# Altium schematic sheet EsquematicoCam.SchDoc
size A4
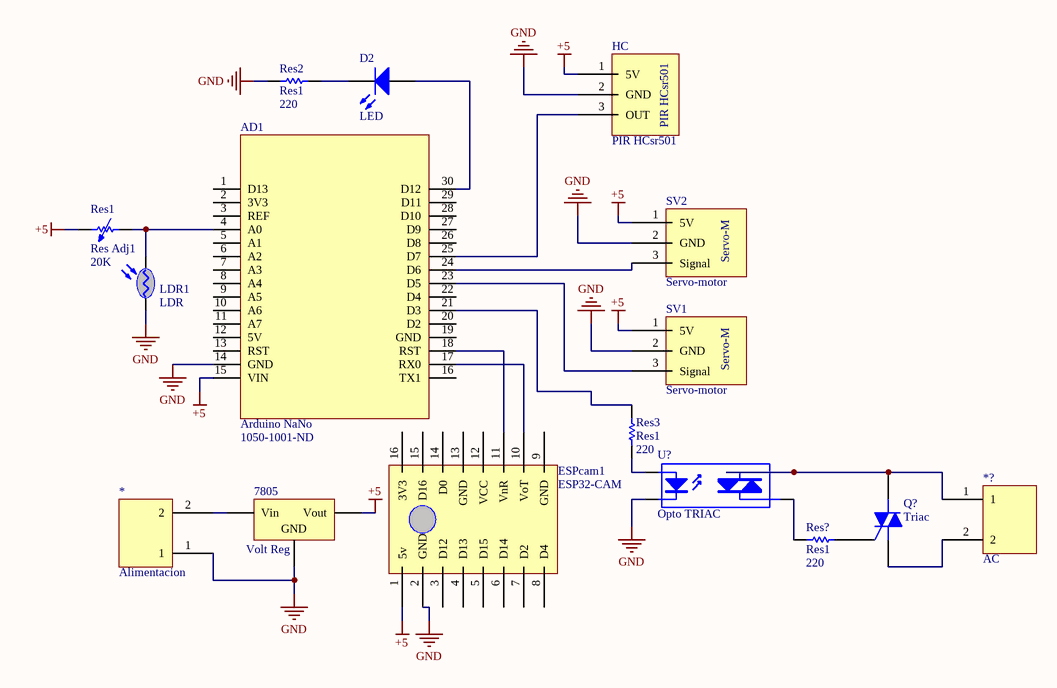
[diagram p0: EsquematicoCam.SchDoc]

## Parts
7805  Volt Reg  [D2PAK_N]
*  Alimentacion  [bornera chica]
*?  AC  [bornera chica]
AD1  Arduino NaNo  Supplier Part Number 1: 1050-1001-ND  [Arduino Nano]
D2  LED  [LED-0 5mm BLUE]
ESPcam1  ESP32-CAM
HC  PIR HCsr501
LDR1  LDR  [CDS]
Q?  Triac  [369-03]
Res1  Res Adj1  value 20K  [AXIAL-0.7]
Res2  Res1  value 220  [AXIAL-0.3]
Res3  Res1  value 220  [AXIAL-0.3]
Res?  Res1  value 220  [AXIAL-0.3]
SV1  Servo-motor
SV2  Servo-motor
U?  Opto TRIAC  [NPSIP4A]

## Nets
+5: 7805.3(Vout) AD1.15(VIN) ESPcam1.1(5v) HC.1(5V) Res1.2 SV1.1(5V) SV2.1(5V)
GND: 7805.2(GND) *.1 AD1.14(GND) ESPcam1.2(GND) HC.2(GND) LDR1.1(A) Res2.1 SV1.2(GND) SV2.2(GND) U?.2(K)
Net7805_1: 7805.1(Vin) *.2
Net*?_1: *?.1 Q?.2(M2) U?.3(A/K)
Net*?_2: *?.2 Q?.1(M1)
NetAD1_4: AD1.4(A0) LDR1.2(K) Res1.1
NetAD1_17: AD1.17(RX0) ESPcam1.10(VoT)
NetAD1_18: AD1.18(RST) ESPcam1.11(VnR)
NetAD1_21: AD1.21(D3) Res3.2
NetAD1_23: AD1.23(D5) SV1.3(Signal)
NetAD1_24: AD1.24(D6) SV2.3(Signal)
NetAD1_25: AD1.25(D7) HC.3(OUT)
NetAD1_30: AD1.30(D12) D2.1(A)
NetD2_2: D2.2(K) Res2.2
NetQ?_3: Q?.3(G) Res?.2
NetRes3_1: Res3.1 U?.1(A)
NetRes?_1: Res?.1 U?.4(A/K)

Not connected (* = marked no-connect by the designer): AD1 1(D13) 2(3V3) 3(REF) 5(A1) 6(A2) 7(A3) 8(A4) 9(A5) 10(A6) 11(A7) 12(5V) 13(RST) 16(TX1) 19(GND) 20(D2) 22(D4) 26(D8) 27(D9) 28(D10) 29(D11); ESPcam1 3(D12) 4(D13) 5(D15) 6(D14) 7(D2) 8(D4) 9(GND) 12(VCC) 13(GND) 14(D0) 15(D16) 16(3V3)

## Notes on the sheet
- (in symbol SERVO-MOTOR) Servo-M

## Library data of the parts
7805 = Volt Reg: Voltage Regulator; Published: 24-Mar-1999; LatestRevisionDate: 29-May-2009; LatestRevisionNote: IPC-7351 Footprint Added.; PackageReference: D2PAK; Publisher: Altium Limited; PackageDescription: 3-Pin Transistor Outline Package 2.54 mm Pitch, 15.1 mm Lead Span
* *? = bornera
D2 = LED: Typical LED; Published: 8-Jun-2000; LatestRevisionDate: 08-Jul-2005; LatestRevisionNote: Mech Layer 1 removed.; PackageReference: LED-1; Publisher: Altium Limited
LDR1 = LDR: Quang Tro
Q? = Triac: Silicon Bidirectional Triode Thyristor; Note: Pin 2 is electrically connected to Pin 4 (TAB); Published: 29-Sep-2000; LatestRevisionDate: 17-Jul-2002; LatestRevisionNote: Re-released for DXP Platform.; DatasheetVersion: 1999; PackageReference: 369-03; Publisher: Altium Limited; PackageDescription: TO, Thru-Hole, Vertical, Heatsink Mounted; 3 In-Line Leads; Pitch 2.28 mm; ComponentLink1Description: Manufacturer Link; ComponentLink1URL: http://www.motorola.com/
Res1 = Res Adj1: Variable Resistor; Set Position: 0.5; Published: 8-Jun-2000; LatestRevisionDate: 17-Jul-2002; LatestRevisionNote: Re-released for DXP Platform.; PackageReference: AXIAL-0.7; Publisher: Altium Limited; PackageDescription: Axial Device, Thru-Hole; 2 Leads; 0.7 in Pin Spacing
Res2 Res3 Res? = Res1: Resistor; Published: 8-Jun-2000; LatestRevisionDate: 17-Jul-2002; LatestRevisionNote: Re-released for DXP Platform.; PackageReference: AXIAL-0.3; Publisher: Altium Limited; PackageDescription: Axial Device, Thru-Hole; 2 Leads; 0.3 in Pin Spacing
U? = Opto TRIAC: Opto-Triac; Published: 24-Mar-1999; LatestRevisionDate: 17-Jul-2002; LatestRevisionNote: Re-released for DXP Platform.; PackageReference: NPSIP4A; Publisher: Altium Limited; PackageDescription: SIP; 4 Leads; Body 10 x 11.5 x 7.5 mm (typ); Pitch 2.54 mm
AD1 = Arduino NaNo: Supplier 1: Digi-Key